# EAGLE design ATTINY_WS2812 (EAGLE 6.3)
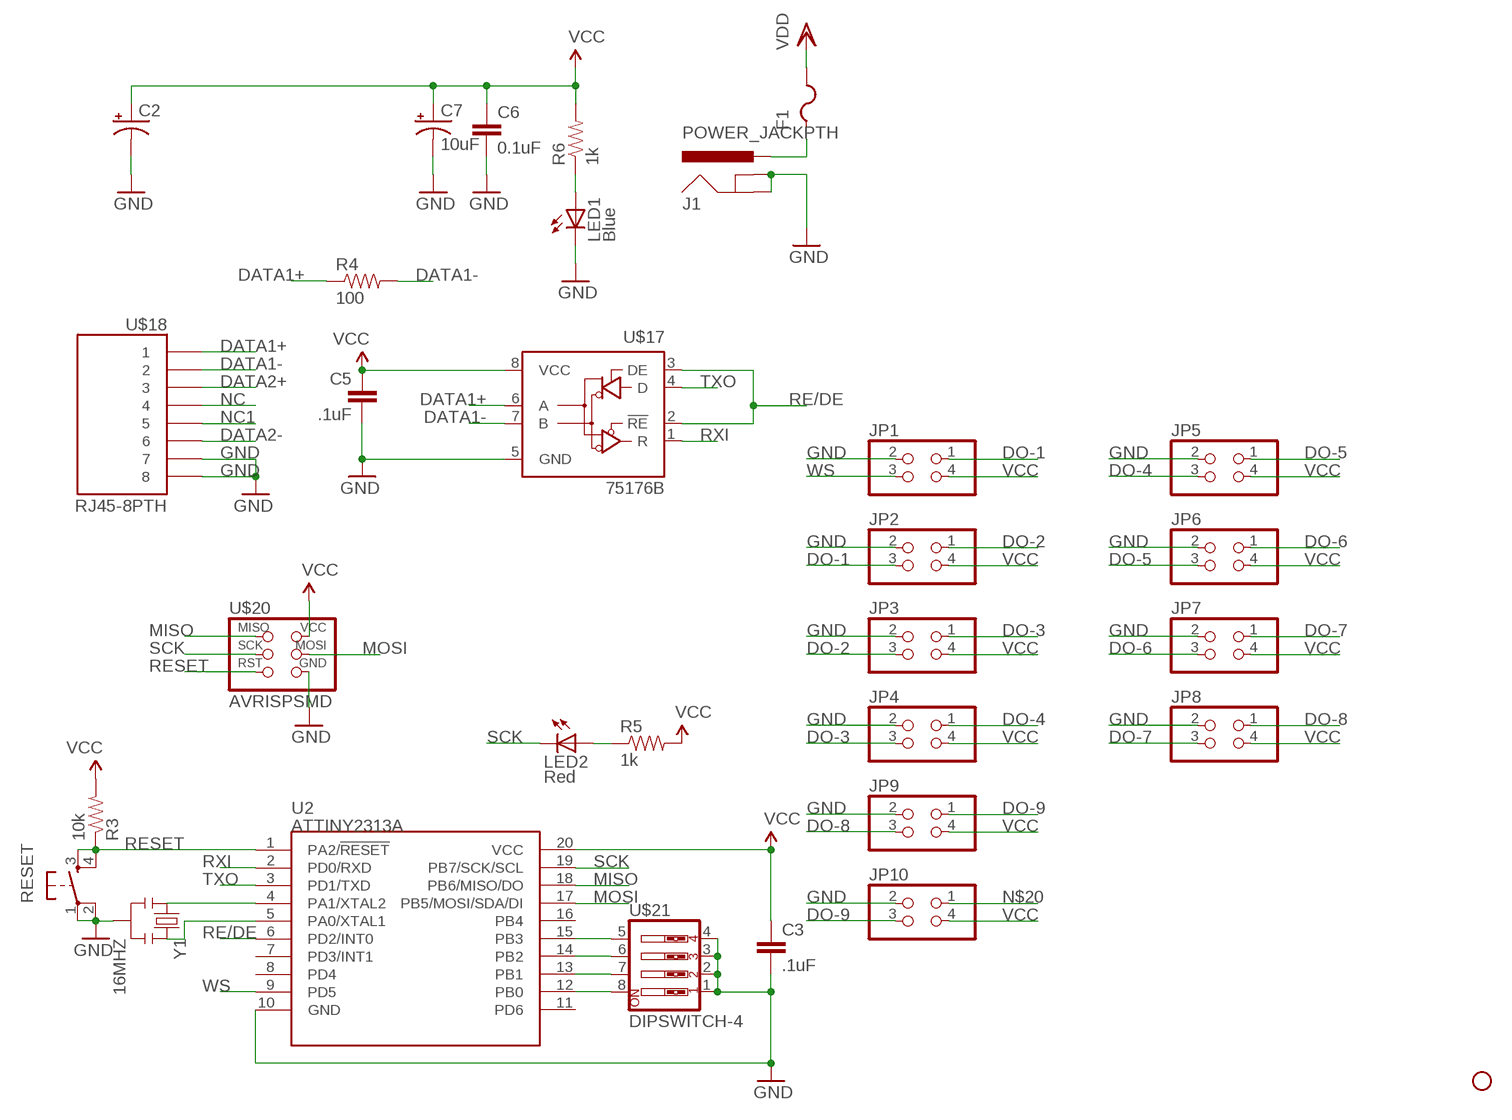
[diagram p0: schematic, sheet 1]

## Parts
C2  CAP_POLC  [PANASONIC_C]
C3  .1uF  CAP0402-CAP  [0402-CAP]
C5  .1uF  CAP0402-CAP  [0402-CAP]
C6  0.1uF  CAP0402-CAP  [0402-CAP]
C7  10uF  CAP_POL1206  [EIA3216]
F1  PTCFUSE-1812  [1812]
J1  POWER_JACKPTH  [POWER_JACK_PTH]
JP1  PINHD-2X2  [2X02]
JP2  PINHD-2X2  [2X02]
JP3  PINHD-2X2  [2X02]
JP4  PINHD-2X2  [2X02]
JP5  PINHD-2X2  [2X02]
JP6  PINHD-2X2  [2X02]
JP7  PINHD-2X2  [2X02]
JP8  PINHD-2X2  [2X02]
JP9  PINHD-2X2  [2X02]
JP10  PINHD-2X2  [2X02]
LED1  Blue  LED0603  [LED-0603]
LED2  Red  LED0603  [LED-0603]
R3  10k  RESISTOR0402-RES  [0402-RES]
R4  100  RESISTOR1206  [1206]
R5  1k  RESISTOR0402  [C0402]
R6  1k  RESISTOR0402  [C0402]
RESET  TAC_SWITCHSMD  [TACTILE_SWITCH_SMD]
STANDOFF1  STAND-OFF  [STAND-OFF]
U2  ATTINY2313A  [SOP20W]
U$17  75176B  [D_R-PDSO-G8]
U$18  RJ45-8PTH  [RJ45-8]
U$20  AVRISPSMD  [2X03SMD]
U$21  DIPSWITCH-4  [DIPSWITCH-04]
Y1  16MHZ  RESONATOR8MHZ  [RESONATOR-SMD]

## Nets
DATA1+: R4.1 U$17.6(A) U$18.1
DATA1-: R4.2 U$17.7(B) U$18.2
DATA2+: U$18.3
DATA2-: U$18.6
DO-1: JP1.1 JP2.3
DO-2: JP2.1 JP3.3
DO-3: JP3.1 JP4.3
DO-4: JP4.1 JP5.3
DO-5: JP5.1 JP6.3
DO-6: JP6.1 JP7.3
DO-7: JP7.1 JP8.3
DO-8: JP8.1 JP9.3
DO-9: JP9.1 JP10.3
GND: C2.- C3.2 C5.2 C6.2 C7.C(-) J1.GND J1.GNDBREAK JP1.2 JP2.2 JP3.2 JP4.2 JP5.2 JP6.2 JP7.2 JP8.2 JP9.2 JP10.2 LED1.C RESET.1 RESET.2 U2.10(GND) U$17.5(GND) U$18.7 U$18.8 U$20.6(GND) U$21.1 U$21.2 U$21.3 U$21.4 Y1.2
MISO: U2.18(PB6/MISO/DO) U$20.1(MISO)
MOSI: U2.17(PB5/MOSI/SDA/DI) U$20.4(MOSI)
N$1: U2.15(PB3) U$21.5
N$2: U2.5(PA0/XTAL1) Y1.3
N$3: U2.14(PB2) U$21.6
N$4: U2.4(PA1/XTAL2) Y1.1
N$6: U2.13(PB1) U$21.7
N$7: LED2.A R5.1
N$8: F1.1 J1.PWR
N$9: U2.12(PB0) U$21.8
N$20: JP10.1
N$38: LED1.A R6.1
NC: U$18.4
NC1: U$18.5
RE/DE: U2.6(PD2/INT0) U$17.2(!RE) U$17.3(DE)
RESET: R3.1 RESET.3 RESET.4 U2.1(PA2/!RESET) U$20.5(RST)
RXI: U2.2(PD0/RXD) U$17.1(R)
SCK: LED2.C U2.19(PB7/SCK/SCL) U$20.3(SCK)
TXO: U2.3(PD1/TXD) U$17.4(D)
VCC: C2.+ C3.1 C5.1 C6.1 C7.A(+) F1.2 JP1.4 JP2.4 JP3.4 JP4.4 JP5.4 JP6.4 JP7.4 JP8.4 JP9.4 JP10.4 R3.2 R5.2 R6.2 U2.20(VCC) U$17.8(VCC) U$20.2(VCC) ; supply symbol labelled VDD
WS: JP1.3 U2.9(PD5)
Unconnected: U2.7(PD3/INT1) U2.8(PD4) U2.11(PD6) U2.16(PB4)

## Library data of the parts
C2 = SparkFun-Capacitors:CAP_POL: Capacitor Polarized These are standard SMD and PTH capacitors. Normally 10uF, 47uF, and 100uF in electrolytic and tantalum varieties. Always verify the external diameter of the through hole cap, it varies with capacity, voltage, and manufacturer. The EIA devices should be standard.
C3 C5 C6 = SparkFun-Capacitors:CAP: Capacitor Standard 0603 ceramic capacitor, and 0.1" leaded capacitor.
C7 = SparkFun:CAP_POL: Capacitor Polarized These are standard SMD and PTH capacitors. Normally 10uF, 47uF, and 100uF in electrolytic and tantalum varieties. Always verify the external diameter of the through hole cap, it varies with capacity, voltage, and manufacturer. The EIA devices should be standard.
F1 = adafruit:PTCFUSE: PTC fuses, resettable thermistors
J1 = SparkFun-Connectors:POWER_JACK: Power Jack This is the standard 5.5mm barrel jack for power. The PTH is the most common, proven, reliable, footprint. The Slot footprint only works if the mill layer is transmitted to the PCB fab house so be warned. Spark Fun Electronics SKU : PRT-00119 SMT: CONN-08106 Mating wall wart : TOL-00298 (and others)
JP1-JP10 = pinhead:PINHD-2X2: PIN HEADER
LED1 LED2 = SparkFun:LED: LEDs Standard schematic elements and footprints for 5mm, 3mm, 1206, and 0603 sized LEDs. 5mm - Spark Fun Electronics SKU : COM-00529 (and others)
R3 R4 = SparkFun-Passives:RESISTOR: Resistor
R5 R6 = SparkFun:RESISTOR: Resistor
RESET = SparkFun-Electromechanical:TAC_SWITCH: Momentary Switch Button commonly used for reset or general input. Spark Fun Electronics SKU : COM-00097 SMT- SWCH-08247; PROD_ID: SWCH-08247
STANDOFF1 = SparkFun-Electromechanical:STAND-OFF: #4 Stand Off This is the mechanical footprint for a #4 phillips button head screw. Use the keepout ring to avoid running the screw head into surrounding components. SKU : PRT-00447
U2 = SparkFun-DigitalIC:ATTINY2313A: ATTINY2313A 2kB 20MHz I2C/SPI/UART; PROD_ID: IC-11305
U$17 = 751xx:75176B: 75176B
U$18 = SparkFun-Connectors:RJ45-8: RJ45 Jack Simple RJ45, 8-pin connection - connector for common Cat5, Cat5e, and Cat6 Ethernet cables. Footprint not yet proven in production. Connector sku is PRT-00643; Breakout PCB sku is BOB-00716.
U$20 = fab:AVRISP
U$21 = SparkFun-Electromechanical:DIPSWITCH-4
Y1 = SparkFun-FreqCtrl:RESONATOR: Resonator Small SMD resonator. Used, eg, on the Arduino Pro/ Pro Mini boards. 8MHz- XTAL-08895 16MHz- XTAL-08900; PROD_ID: XTAL-08895; VALUE: 8MHZ

## Net classes
1 vcc: width 0.254 mm

## Board
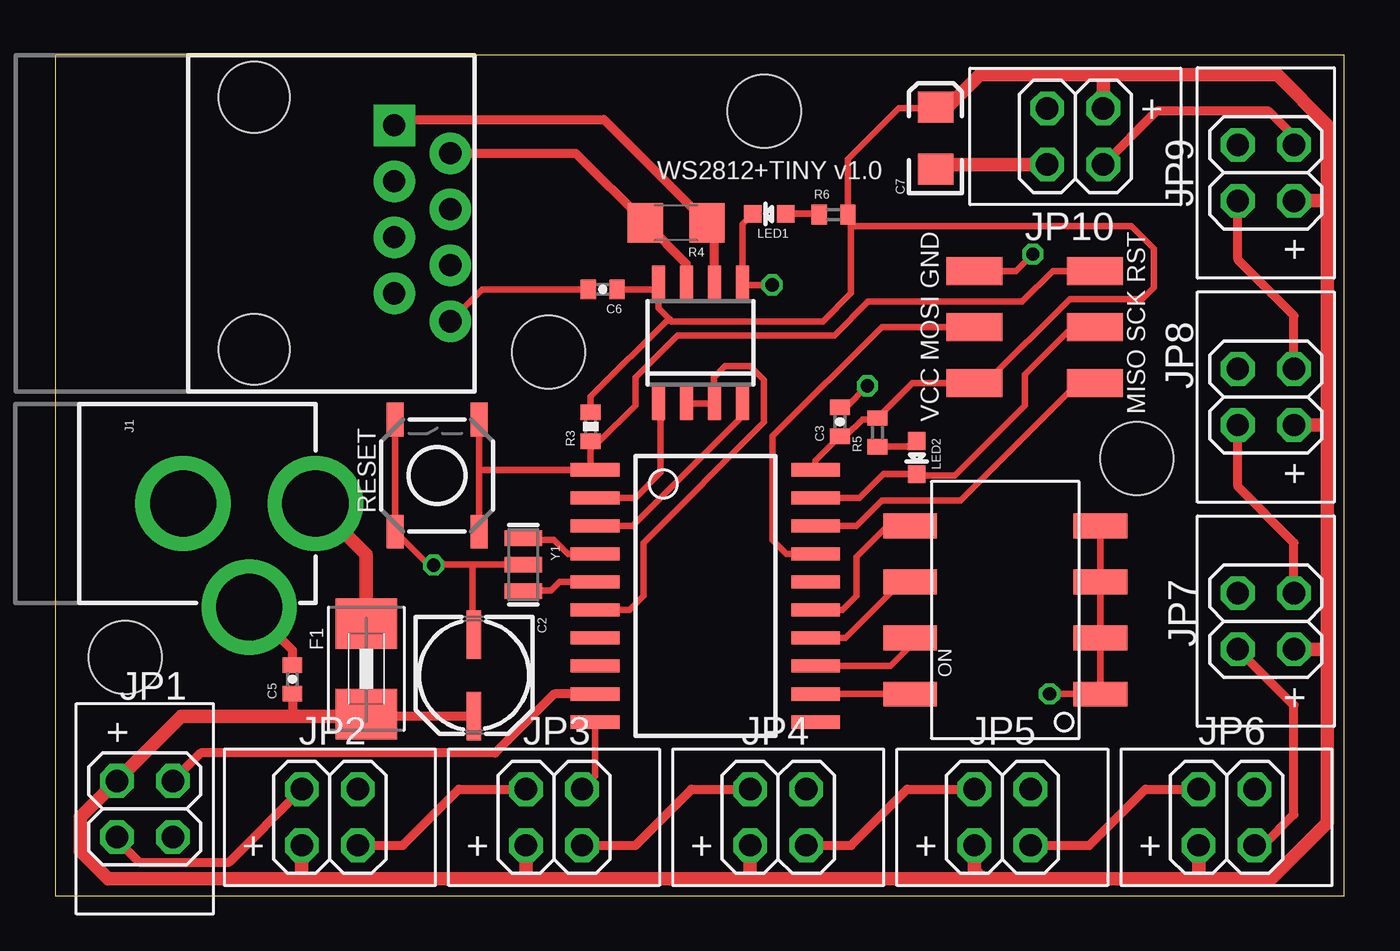
[diagram p1: board, top side]
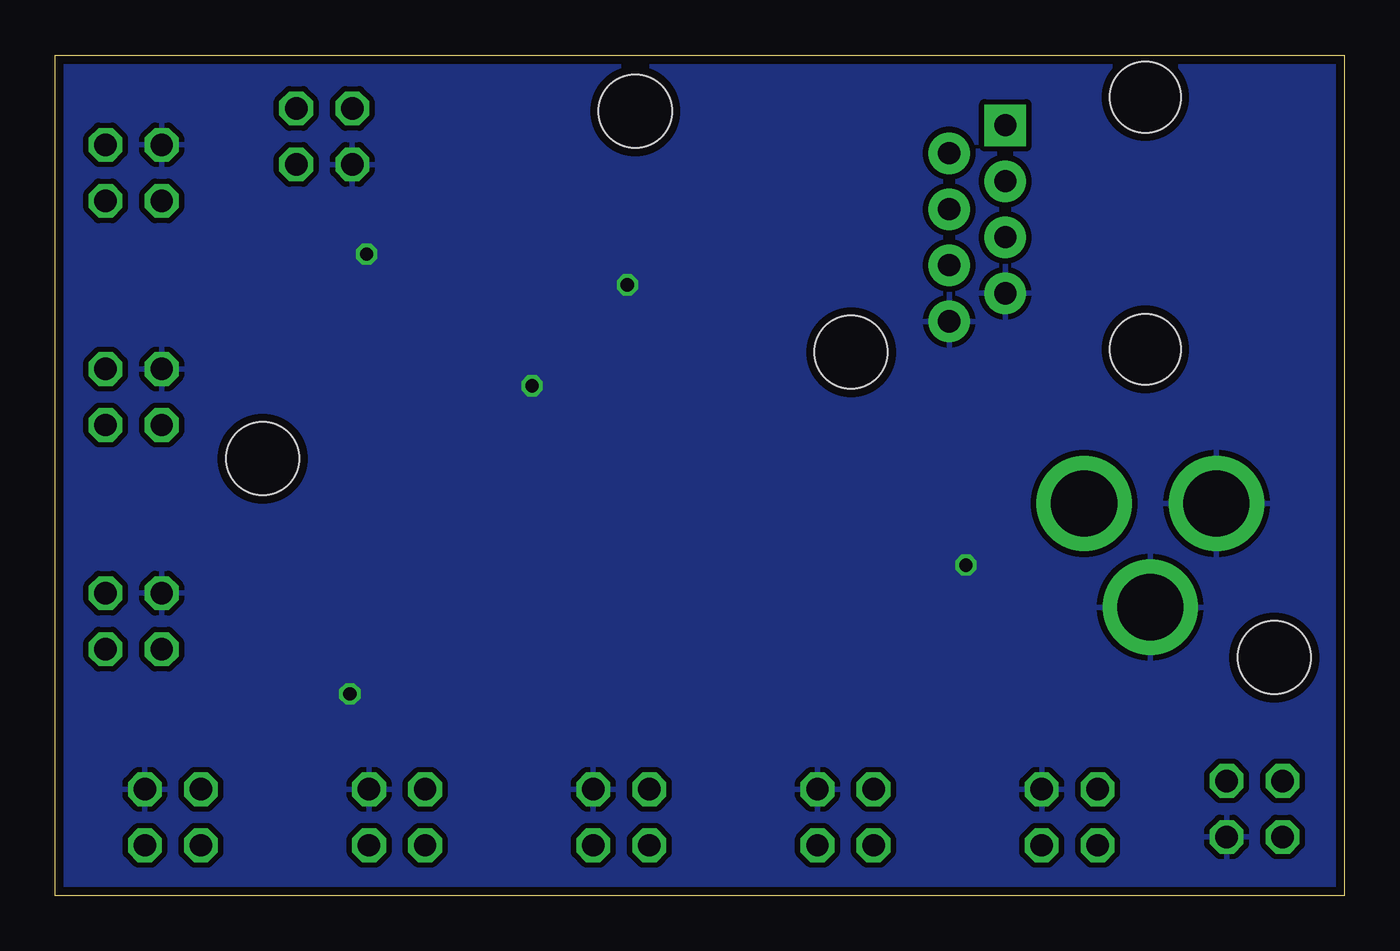
[diagram p2: board, bottom side, seen from below]

Size 58.42 x 38.1 mm. Coordinates in mm from the lower left corner, seen from the top.
Outline: 0,0 58.42,0 58.42,38.1 0,38.1 0,0
Copper layers (1*16): Top 0.0356mm / dielectric 1.5011mm / Bottom 0.0356mm
Design rules "LaenPCBOrder *": minimum track width 6mil, minimum drill 13mil, track to track 10mil, track to pad 6mil, pad to pad 6mil, via to via 6mil, smd to smd 6mil, copper to edge 15mil, drill to drill 6mil, minimum pad ring 7mil, minimum via ring 7mil, stop-mask expansion 4mil, vias tented up to drill 0mil, thermal gap 10mil

### Footprints (pad centres in the part's own frame; a part is rotated, then mirrored left to right if it is on the bottom)
PANASONIC_C = smd 2.2 x 0.65: + 1.9,-0.2; - -1.8,-0.2
0402-CAP = smd 0.7 x 0.9: 1 -0.65,0; 2 0.65,0
EIA3216 = smd 1.4 x 1.6: A 1.4,0; C -1.4,0
1812 = smd 2.286 x 2.794: 1 -2.046,0; 2 2.046,0
POWER_JACK_PTH = drill 2.997 pad 4.318: GND 0,7.7; GNDBREAK 4.7,10.7; PWR 0,13.7
2X02 = drill 1.016 octagon: 1 -1.27,1.27; 2 -1.27,-1.27; 3 1.27,-1.27; 4 1.27,1.27
LED-0603 = smd 0.8 x 0.8: A 0,-0.75; C 0,0.75
0402-RES = smd 0.7 x 0.9: 1 -0.65,0; 2 0.65,0
1206 = smd 1.6 x 1.8: 1 -1.4,0; 2 1.4,0
C0402 = smd 0.7 x 0.9: 1 -0.65,0; 2 0.65,0
TACTILE_SWITCH_SMD = smd 1.524 x 0.762: 1 -2.54,1.905; 2 2.54,1.905; 3 -2.54,-1.905; 4 2.54,-1.905
STAND-OFF = hole 3.302: 0,0
SOP20W = smd 0.6 x 2.2: 1 -5.715,-5; 2 -4.445,-5; 3 -3.175,-5; 4 -1.905,-5; 5 -0.635,-5; 6 0.635,-5; 7 1.905,-5; 8 3.175,-5; 9 4.445,-5; 10 5.715,-5; 11 5.715,5; 12 4.445,5; 13 3.175,5; 14 1.905,5; 15 0.635,5; 16 -0.635,5; 17 -1.905,5; 18 -3.175,5; 19 -4.445,5; 20 -5.715,5
D_R-PDSO-G8 = smd 0.6 x 1.5: 1 -1.905,-2.75; 2 -0.635,-2.75; 3 0.635,-2.75; 4 1.905,-2.75; 5 1.905,2.75; 6 0.635,2.75; 7 -0.635,2.75; 8 -1.905,2.75
RJ45-8 = drill 1 pad 1.88 square: 1 -4.445,6.35 | drill 1 pad 1.88: 2 -3.175,8.89; 3 -1.905,6.35; 4 -0.635,8.89; 5 0.635,6.35; 6 1.905,8.89; 7 3.175,6.35; 8 4.445,8.89 | hole 3.2: -5.715,0; 5.715,0
2X03SMD = smd 2.54 x 1.27: 1 -2.54,2.54; 2 2.92,2.54; 3 -2.54,0; 4 2.92,0; 5 -2.54,-2.54; 6 2.92,-2.54
DIPSWITCH-04 = smd 1.118 x 2.438: 1 -3.81,-4.305; 2 -1.27,-4.305; 3 1.27,-4.305; 4 3.81,-4.305; 5 3.81,4.305; 6 1.27,4.305; 7 -1.27,4.305; 8 -3.81,4.305
RESONATOR-SMD = smd 0.7 x 1.7: 1 -1.2,0; 2 0,0; 3 1.2,0

### Placement (x,y rotation side)
C2  19.18,10.03 270 top
C3  35.56,21.48 90 top
C5  10.75,9.81 90 top
C6  24.81,27.48 180 top
C7  39.9,34.34 90 top
F1  14.1,10.29 270 top
J1  -1.91,17.78 270 top
JP1  4.06,3.94 90 top
JP2  12.45,3.56 180 top
JP3  22.61,3.56 180 top
JP4  32.77,3.56 180 top
JP5  42.93,3.56 180 top
JP6  53.09,3.56 180 top
JP7  54.86,12.45 270 top
JP8  54.86,22.61 270 top
JP9  54.86,32.77 270 top
JP10  46.23,34.42 0 top
LED1  32.35,30.91 90 top
LED2  39.04,19.86 180 top
R3  24.27,21.26 90 top
R4  28.14,30.5 180 top
R5  37.26,21 90 top
R6  35.28,30.87 0 top
RESET  17.31,19.05 90 top
STANDOFF1  32.13,35.56 0 top
STANDOFF2  STAND-OFF  [STAND-OFF]  3.17,10.79 0 top
STANDOFF3  STAND-OFF  [STAND-OFF]  49.02,19.81 0 top
STANDOFF4  STAND-OFF  [STAND-OFF]  22.35,24.64 0 top
U2  29.46,13.59 270 top
U$17  29.24,25.06 0 top
U$18  9.02,30.48 270 top
U$20  44.58,25.78 180 top
U$21  43.05,12.95 90 top
Y1  21.21,15.01 270 top

### Tracks (layer width: path | path; a pad name or v marks a point on that pad's centre or on a via)
DATA1+
  Top 0.305: U$17.6 29.89,27.83
  Top 0.406: U$17.6 29.88,30.16 R4.1 24.86,35.18 15.62,35.18 U$18.1
DATA1-
  Top 0.406: U$17.7 28.61,28.63 R4.2 23.59,33.66 U$18.2
DO-1
  Top 0.406: JP1.1 2.79,2.54 3.81,1.52 7.87,1.52 JP2.3
DO-2
  Top 0.406: JP2.1 15.75,2.29 18.29,4.83 JP3.3
DO-3
  Top 0.406: JP3.1 26.29,2.29 28.83,4.83 JP4.3
DO-4
  Top 0.406: JP4.1 36.07,2.29 38.61,4.83 JP5.3
DO-5
  Top 0.406: JP5.1 46.86,2.29 49.4,4.83 JP6.3
DO-6
  Top 0.406: JP6.1 54.74,2.29 56.13,3.68 56.13,8.64 JP7.3
DO-7
  Top 0.406: JP7.1 56.13,16 53.59,18.54 JP8.3
DO-8
  Top 0.406: JP8.1 56.13,26.29 53.59,28.83 JP9.3
DO-9
  Top 0.406: JP9.1 56.13,34.42 54.99,35.56 49.91,35.56 JP10.3
GND  (via drill 0.6)
  Top 0.305: U$21.4 U$21.3 U$21.2 U$21.1 47.74,9.15 v45.06,9.15 | U2.10 24.46,5.41 JP3.2 | C2.- 18.92,11.89 18.92,15.01 | RESET.2 RESET.1 16.9,15.01 17.16,15.01 | Y1.2 18.92,15.01 | 18.92,15.01 17.16,15.01 | 17.16,15.01 v17.14,14.99 | LED1.C 31.15,30.45 U$17.5 31.27,27.69 v32.49,27.69 | C6.2 19.36,27.48 U$18.8 | U$20.6 43.54,28.32 v44.3,29.09 | C3.2 35.83,22.13 v36.81,23.12
  Top 0.406: C5.2 10.75,11.12 J1.GNDBREAK
  Top 0.61: JP10.2 40.11,33.15 C7.C
  pour Bottom: 0,0 0,38.1 58.42,38.1 58.42,0
MISO
  Top 0.305: U2.18 36.32,16.76 37.47,17.91 41.02,17.91 46.35,23.24 U$20.1
MOSI
  Top 0.305: U2.17 33.15,15.49 32.51,16.13 32.51,20.83 37.47,25.78 U$20.4
N$1
  Top 0.305: U$21.5 37.72,16.76 36.32,15.37 36.32,13.59 35.69,12.95 U2.15
N$2
  Top 0.305: U2.5 22.86,14.22 22.48,13.84 21.25,13.84 Y1.3
N$3
  Top 0.305: 38.99,14.22 U$21.6 38.35,14.22 35.81,11.68 U2.14
N$4
  Top 0.305: U2.4 23.24,15.49 22.61,16.13 21.29,16.13 Y1.1
N$6
  Top 0.305: U2.13 37.86,10.41 39.13,11.68 U$21.7
N$7
  Top 0.305: R5.1 38.78,20.35 LED2.A
N$8
  Top 0.61: F1.1 14.1,15.48 J1.PWR
N$9
  Top 0.305: U$21.8 U2.12
N$38
  Top 0.305: LED1.A 34.59,30.91 R6.1
RE/DE
  Top 0.305: U$17.2 U$17.3 29.84,22.34 29.84,23.5 30.35,24 31.5,24 32.13,23.37 32.13,21.46 26.67,16 26.67,13.59 26.04,12.95 U2.6
RESET
  Top 0.305: RESET.4 19.21,19.3 | 19.21,19.3 RESET.3 | 19.21,19.3 U2.1 24.27,19.5 R3.1 24.67,20.61 26.29,22.23 26.29,23.5 28.19,25.4 35.31,25.4 36.83,26.92 43.81,26.92 45.21,28.32 U$20.5
RXI
  Top 0.305: U2.2 26.29,18.03 27.43,19.18 27.43,22.22 U$17.1
SCK
  Top 0.305: U2.19 36.45,18.03 37.52,19.11 LED2.C 39.1,19.05 40.77,19.05 43.94,22.23 43.94,23.62 46.1,25.78 U$20.3
TXO
  Top 0.305: U$17.4 31.15,21.75 26.16,16.76 U2.3
VCC
  Top 0.305: 27.3,27.84 U$17.8 27.34,27.3 | 37.33,21.72 R5.2 | R5.2 37.2,21.59 36.58,21.59 35.82,20.83 C3.1 34.46,19.74 U2.20 | C7.A 39.85,35.69 38.23,35.69 35.92,33.38 R6.2 36.07,30.73 36.07,30.35 | 27.34,27.3 27.34,26.64 27.81,26.16 | 27.81,26.16 27.94,26.04 34.8,26.04 36.07,27.3 36.07,30.35 | C6.1 27.16,27.48 27.34,27.3 | R3.2 24.27,22.62 27.81,26.16 | 36.07,30.35 48.77,30.35 49.78,29.34 49.78,27.56 49.28,27.05 45.97,27.05 42.16,23.24 U$20.2 38.85,23.24 R5.2
  Top 0.406: C2.+ 14.61,8.13 14.21,8.13 F1.2 | C5.1 10.75,8.21 10.67,8.13
  Top 0.61: 11.18,0.76 2.41,0.76 1.14,2.03 1.14,3.56 JP1.4 5.71,8.13 10.67,8.13 14.6,8.13 14.61,8.13 | 11.18,0.76 21.46,0.76 | 21.46,0.76 31.62,0.76 | 31.62,0.76 42.04,0.76 | 42.04,0.76 51.82,0.76 | 51.82,0.76 55.12,0.76 57.66,3.3 57.66,11.05 | 21.46,0.76 21.34,0.89 JP3.4 | 57.66,21.21 57.66,31.5 | 57.66,31.5 57.66,34.92 55.37,37.21 47.5,37.21 | JP8.4 57.53,21.34 57.66,21.21 | JP9.4 57.66,31.5 | JP6.4 51.82,0.76 | JP5.4 41.66,1.14 42.04,0.76 | JP4.4 31.5,0.89 31.62,0.76 | JP2.4 11.18,0.76 | 57.66,21.21 57.66,11.05 | JP7.4 57.53,11.18 57.66,11.05 | C7.A 40.44,35.74 41.91,37.21 47.5,37.21 | JP10.4 47.5,37.21
WS
  Top 0.406: U2.9 22.61,9.14 19.94,6.48 6.6,6.48 JP1.3

### Text on the board
tPlace: WS2812+TINY v1.0
tNames: VCC MOSI GND / / / / / MISO SCK RST